# Altium schematic sheet Camera.SchDoc: Camera
size A4; Author: P.A.; CompanyName: STMicroelectronics; Organization: Microcontrollers Division; Address1: 12, Rue Jules HOROWITZ; Address2: 38019 Grenoble; Address3: FRANCE; DocumentNumber: MB1261; Revision: B.01; SheetNumber: 13; SheetTotal: 15; Project: STM32L496G-DISCO
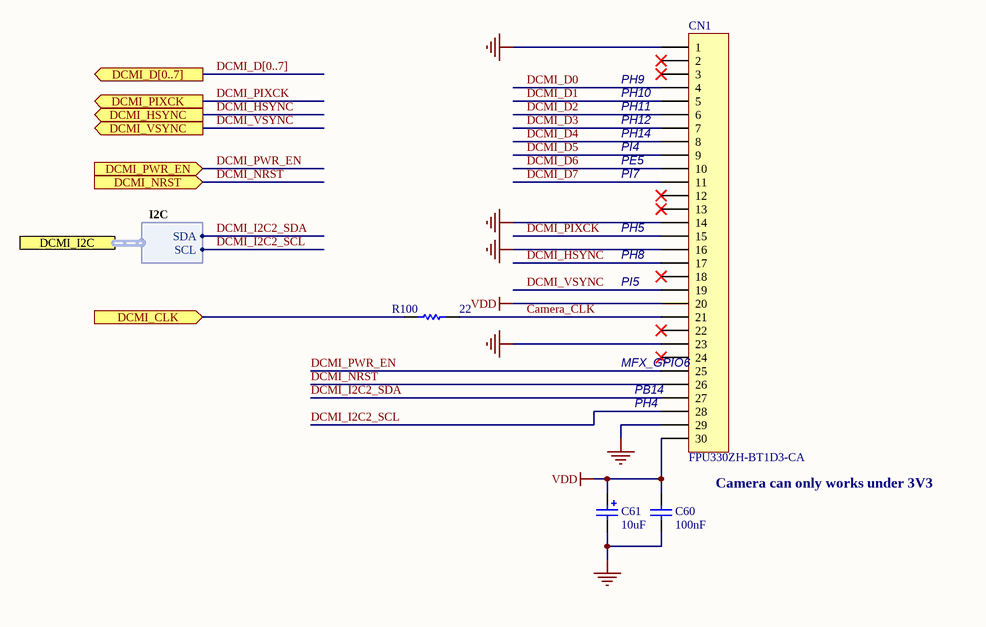
[diagram p0: Camera.SchDoc]

## Parts
C60  value 100nF  [0603C]  (hidden comment: CC0603KRX7R7BB104)
C61  value 10uF  [TAN-A]  (hidden comment: TAJA106K016R)
CN1  FPU330ZH-BT1D3-CA  [FPU330ZH-BT1D3-CA]
R100  value 22  [0603R]  (hidden comment: RC0603JR-0722RL)

## Ports
DCMI_CLK (in), DCMI_D[0..7] (out), DCMI_HSYNC (out), DCMI_I2C (harness I2C), DCMI_NRST (in), DCMI_PIXCK (out), DCMI_PWR_EN (in), DCMI_VSYNC (out)

## Harnesses
I2C: SDA, SCL

## Nets
GND: C60.2 C61.2 CN1.1 CN1.14 CN1.16 CN1.23 CN1.29
VDD: C60.1 C61.1 CN1.20 CN1.30
Camera_CLK: CN1.21 R100.1
DCMI_CLK: R100.2 ; port DCMI_CLK
DCMI_D0: CN1.4
DCMI_D1: CN1.5
DCMI_D2: CN1.6
DCMI_D3: CN1.7
DCMI_D4: CN1.8
DCMI_D5: CN1.9
DCMI_D6: CN1.10
DCMI_D7: CN1.11
DCMI_HSYNC: CN1.17 ; port DCMI_HSYNC
DCMI_I2C2_SCL: CN1.28 ; port DCMI_I2C.SCL
DCMI_I2C2_SDA: CN1.27 ; port DCMI_I2C.SDA
DCMI_NRST: CN1.26 ; port DCMI_NRST
DCMI_PIXCK: CN1.15 ; port DCMI_PIXCK
DCMI_PWR_EN: CN1.25 ; port DCMI_PWR_EN
DCMI_VSYNC: CN1.19 ; port DCMI_VSYNC

Not connected (* = marked no-connect by the designer): CN1 2* 3* 12* 13* 18* 22* 24*

## Buses and harness runs
bus DCMI_D[0..7] = port DCMI_D[0..7]

## Notes on the sheet
- (near CN1) PH10
- (near CN1) PH11
- (near CN1) PH9
- (near CN1) PE5
- (near CN1) PH12
- (near CN1) PH14
- (near CN1) PI4
- (near CN1) PI7
- (near CN1) PH5
- (near CN1) PH8
- (near CN1) PI5
- (near CN1) MFX_GPIO6
- (near CN1) PH4
- (near CN1) PB14
- Camera can only works under 3V3
- Title:
- Project:
- Size:
- Revision:
- Variant:
- A4
- -
- Date:
- Reference:
- Sheet:
- of

## Library data of the parts
C60 = Cap: Capacitor,100nF,10%,16V,X7R,0603,YAGEO; Ordered by: Subcon; Published: 8-Jun-2000; Revision: July-2002: Re-released for DXP Platform.; Publisher: Altium Limited; Manuf_1: YAGEO; Manuf_Part_1: CC0603KRX7R7BB104
C61 = Cap Pol1: TAN Capacitor,10uF,10%,16V,A Type,AVX; Ordered by: Subcon; ECCN_US/EU: NA; Published: 8-Jun-2000; Revision: July-2002: Re-released for DXP Platform.; Publisher: Altium Limited; Manuf_1: AVX; Manuf_Part_1: TAJA106K016R
CN1 = FPU330ZH-BT1D3-CA: TOWNES -  Connector FFC/FPC ZIF 0.5mm 30 pins, Lower Contacts; Manuf_Part_2: TFP-A330ZH-BT1-ECX; Ordered by: Subcon; Manuf_Part_1: FPU330ZH-BT1D3-CA; Order: *; Manuf_1: TOWNES; Distrib: Sub Co; ECCN_US/EU: n/a; Manuf_2: TOWNES
R100 = res1: Resistor, 22 ,0603,1%,YAGEO; Ordered by: Subcon; ECCN_US/EU: NA; Published: 8-Jun-2000; Revision: July-2002: Re-released for DXP Platform.; Publisher: Altium Limited; Manuf_1: YAGEO; Manuf_Part_1: RC0603JR-0722RL